# EAGLE design BeatlePad (EAGLE 9.2.0)
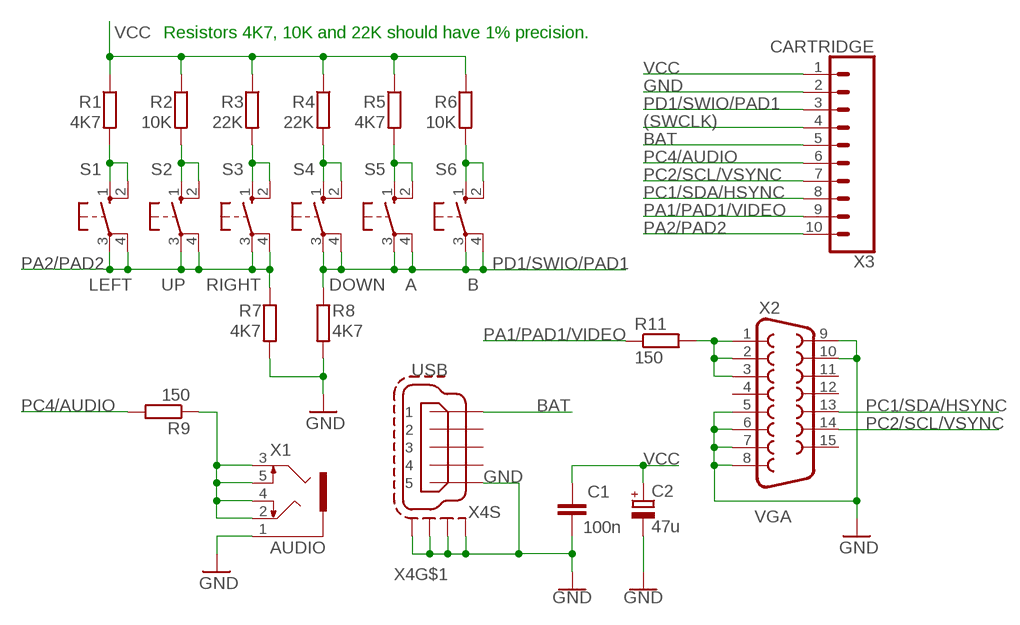
[diagram p0: schematic, sheet 1]

## Parts
C1  100n  C-EU025-024X044  [C025-024X044]
C2  47u  CPOL-EUE2-4  [E2-4]
R1  4K7  R-EU_0204/2V  [0204V]
R2  10K  R-EU_0204/2V  [0204V]
R3  22K  R-EU_0204/2V  [0204V]
R4  22K  R-EU_0204/2V  [0204V]
R5  4K7  R-EU_0204/2V  [0204V]
R6  10K  R-EU_0204/2V  [0204V]
R7  4K7  R-EU_0204/5  [0204/5]
R8  4K7  R-EU_0204/2V  [0204V]
R9  150  R-EU_0204/5  [0204/5]
R11  150  R-EU_0204/5  [0204/5]
S1  LEFT  10-XXB3F-10XXB  [B3F-10XXB]
S2  UP  10-XXB3F-10XXB  [B3F-10XXB]
S3  RIGHT  10-XXB3F-10XXB  [B3F-10XXB]
S4  DOWN  10-XXB3F-10XXB  [B3F-10XXB]
S5  A  10-XXB3F-10XXB  [B3F-10XXB]
S6  B  10-XXB3F-10XXB  [B3F-10XXB]
X1  AUDIO  1503_09  [1503_09]
X2  VGA  F15HDH  [HDF15H]
X3  CARTRIDGE  CONN_10  [1X10_LONGPADS]
X4  USB  MINI-USB-SCHIELD-32005-201  [32005-201]

## Nets
(SWCLK): X3.4
A: R5.2 S5.1(S) S5.2(S1)
B: R6.2 S6.1(S) S6.2(S1)
BAT: X3.5 X4.1
DOWN: R4.2 S4.1(S) S4.2(S1)
GND: C1.2 C2.- R7.2 R8.2 X1.1 X2.5 X2.6 X2.7 X2.8 X2.9 X2.10 X3.2 X4.5 X4.M1(S:S1) X4.M2(S:S2) X4.M3(S:S3) X4.M4(S:S4)
LEFT: R1.2 S1.1(S) S1.2(S1)
N$1: R11.2 X2.1 X2.2 X2.3
N$2: R9.1 X1.2 X1.3 X1.4 X1.5
PA1/PAD1/VIDEO: R11.1 X3.9
PA2/PAD2: R7.1 S1.3(P) S1.4(P1) S2.3(P) S2.4(P1) S3.3(P) S3.4(P1) X3.10
PC1/SDA/HSYNC: X2.13 X3.8
PC2/SCL/VSYNC: X2.14 X3.7
PC4/AUDIO: R9.2 X3.6
PD1/SWIO/PAD1: R8.1 S4.3(P) S4.4(P1) S5.3(P) S5.4(P1) S6.3(P) S6.4(P1) X3.3
RIGHT: R3.2 S3.1(S) S3.2(S1)
UP: R2.2 S2.1(S) S2.2(S1)
VCC: C1.1 C2.+ R1.1 R2.1 R3.1 R4.1 R5.1 R6.1 X3.1
Unconnected: X2.4 X2.11 X2.12 X2.15 X4.2 X4.3 X4.4

## Notes on the sheet
- Resistors 4K7, 10K and 22K should have 1% precision.

## Library data of the parts
C1 = rcl:C-EU: CAPACITOR, European symbol; SPICEPREFIX: C
C2 = rcl:CPOL-EU: POLARIZED CAPACITOR, European symbol; SPICEPREFIX: C
R1-R9 R11 = rcl:R-EU_: RESISTOR, European symbol; SPICEPREFIX: R
S1-S6 = switch-omron2:10-XX: OMRON SWITCH
X1 = con-lumberg:1503_09: Jack connectors according to JISC 6560, 3.5 mm Klinkeneinbaukupplung nach JISC 6560, 3,5 mm, 3-polig/ stereo, abgewinkelte Ausführung, mit 2 Öffnern und Lötaugen, für Leiterplatten Rückseitenmontage Source: http://www.lumberg.com/Produkte/PDFs/1503_09.pdf; OC_FARNELL: 1243244; OC_NEWARK: unknown
X2 = adafruit_B:F15: SUB-D HDH is also known as a 'right angle VGA' connector
X3 = SparkFun-Connectors:CONN_10: Multi connection point. Often used as Generic Header-pin footprint for 0.1 inch spaced/style header connections On any of the 0.1 inch spaced packages, you can populate with these: Break Away Headers - Straight <https://www.sparkfun.com/products/116> (PRT-00116) Break Away Male Headers - Right Angle <https://www.sparkfun.com/products/553> (PRT-00553) Female Headers <https://www.sparkfun.com/products/115> (PRT-00115) Break Away Headers - Machine Pin <https://www.sparkfun.com/products/117> (PRT-00117) Break Away Female Headers - Swiss Machine Pin <https://www.sparkfun.com/products/743> (PRT-00743) Arduino Stackable Header - 10 Pin <https://www.sparkfun.com/products/11376> (PRT-11376) For SCREWTERMINALS and SPRING TERMINALS visit here: Screw Terimnals on SparkFun.com <https://www.sparkfun.com/search/results?term=Screw+Terminals> (5mm/3.5mm/2.54mm spacing) This device is also useful as a general connection point to wire up your design to another part of your project. Our various solder wires solder well into these plated through hole pads. Hook-Up Wire - Assortment (Stranded, 22 AWG) <https://www.sparkfun.com/products/11375> (PRT-11375) Hook-Up Wire - Assortment (Solid Core, 22 AWG) <https://www.sparkfun.com/products/11367> (PRT-11367) View the entire wire category on our website here <https://www.sparkfun.com/categories/141> Special notes: Molex polarized connector foot print use with SKU : PRT-08231 with associated crimp pins and housings. 1MM SMD Version SKU: PRT-10208 NOTES ON THE VARIANTS LOCK and LOCK_LONGPADS... This footprint was designed to help hold the alignment of a through-hole component (i.e. 6-pin header) while soldering it into place. You may notice that each hole has been shifted either up or down by 0.005 of an inch from it's more standard position (which is a perfectly straight line). This slight alteration caused the pins (the squares in the middle) to touch the edges of the holes. Because they are alternating, it causes a "brace" to hold the component in place. 0.005 has proven to be the perfect amount of "off-center" position when using our standard breakaway headers. Although looks a little odd when you look at the bare footprint, once you have a header in there, the alteration is very hard to notice. Also,if you push a header all the way into place, it is covered up entirely on the bottom side.
X4 = con-cypressindustries:MINI-USB-SCHIELD-: MINI USB-B Conector Source: www.cypressindustries.com; OC_FARNELL: unknown; OC_NEWARK: unknown

## Board
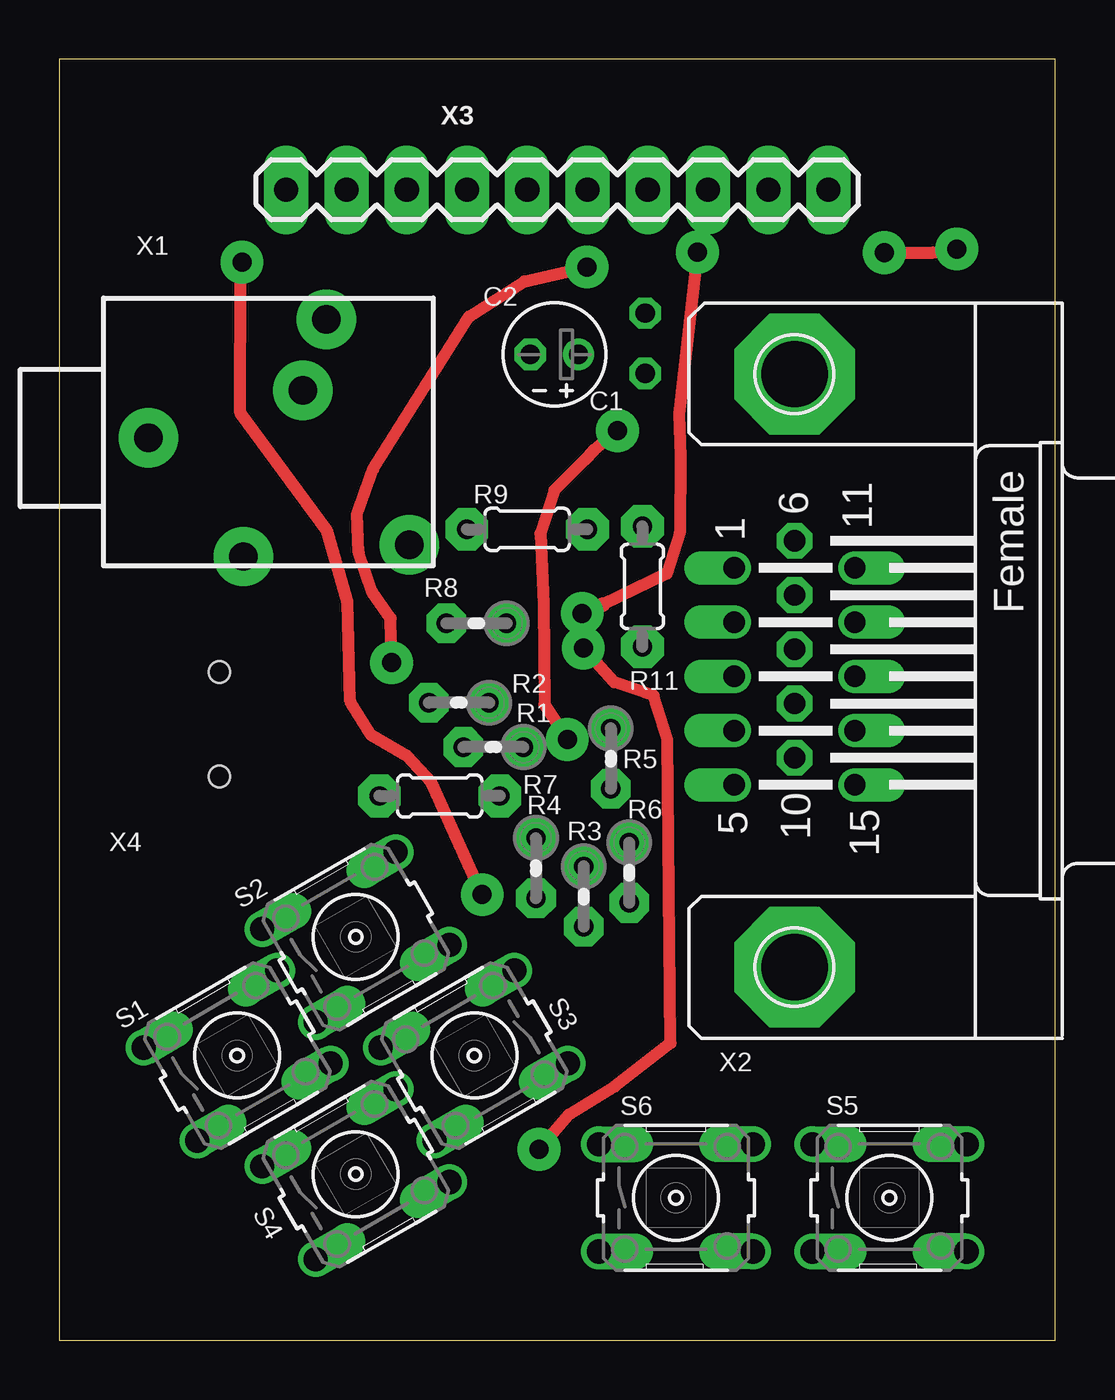
[diagram p1: board, top side]
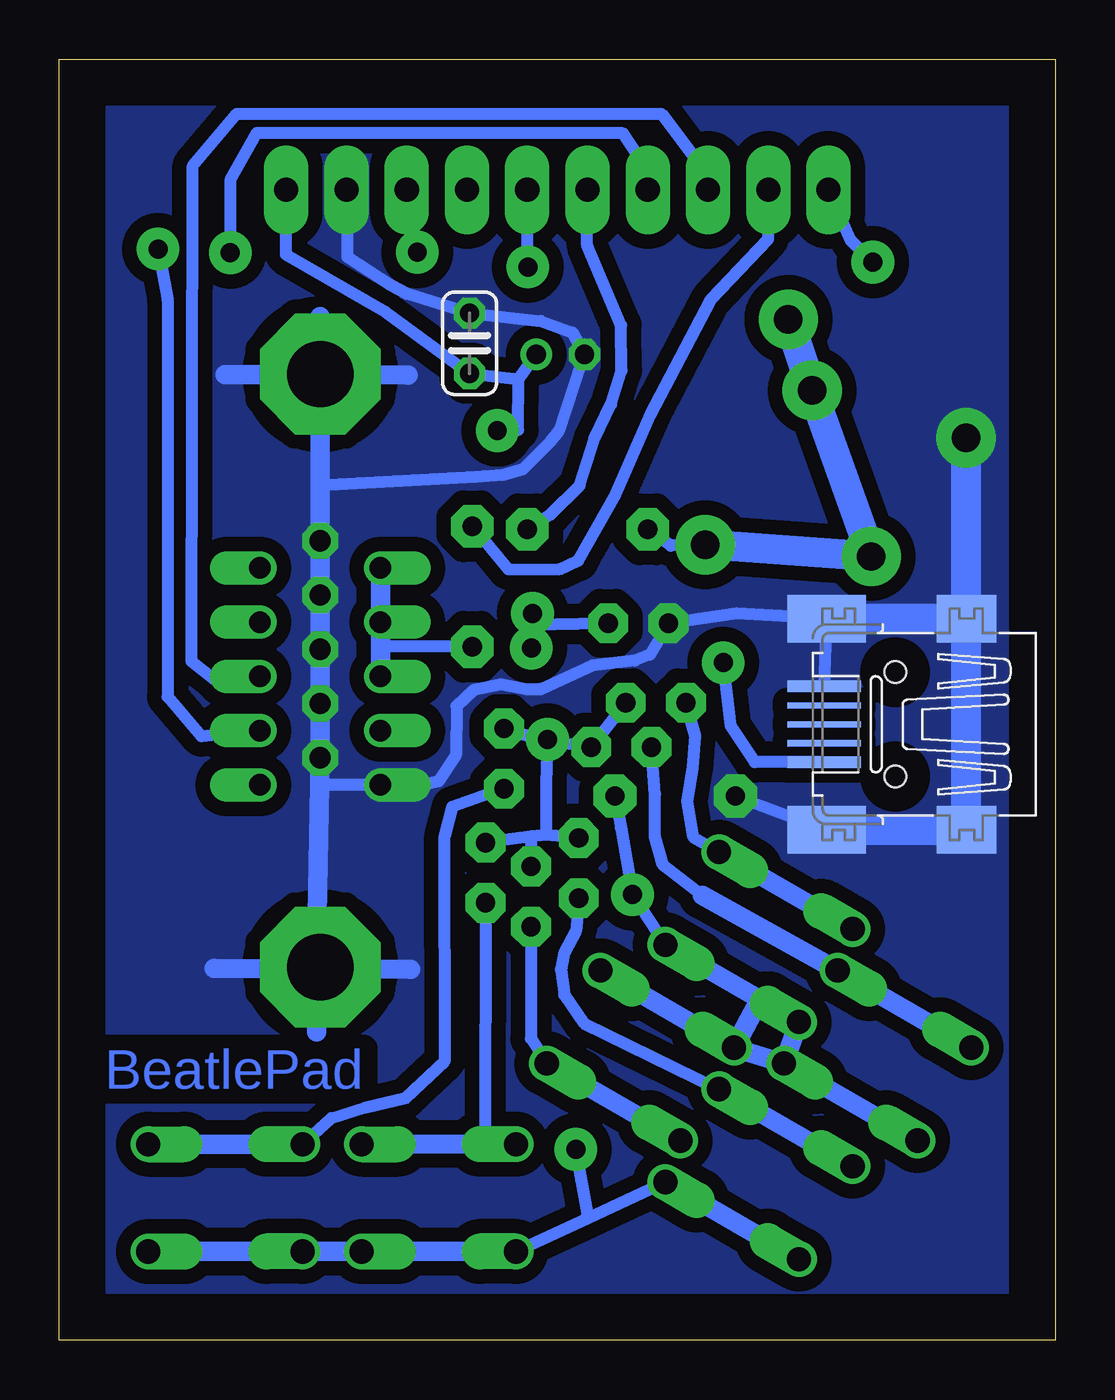
[diagram p2: board, bottom side, seen from below]

Size 42 x 54 mm. Coordinates in mm from the lower left corner, seen from the top.
Outline: 0,0 42,0 42,54 0,54 0,0
Copper layers (1*16): Top 0.035mm / dielectric 1.5mm / Bottom 0.035mm
Design rules "default": minimum track width 6mil, minimum drill 0.35mm, track to track 6mil, track to pad 6mil, pad to pad 6mil, via to via 6mil, smd to smd 6mil, copper to edge 40mil, drill to drill 6mil, minimum pad ring 10mil, minimum via ring 8mil, stop-mask expansion 4mil, vias tented up to drill 0mil, thermal gap 10mil

### Footprints (pad centres in the part's own frame; a part is rotated, then mirrored left to right if it is on the bottom)
C025-024X044 = drill 0.813 octagon: 1 -1.27,0; 2 1.27,0
E2-4 = drill 0.813 pad 1.27: + -1.016,0 | drill 0.813 pad 1.27 octagon: - 1.016,0
0204V = drill 0.813 pad 1.676 octagon: 1 -1.27,0; 2 1.27,0
0204/5 = drill 0.813 pad 1.8 octagon: 1 -2.54,0; 2 2.54,0
B3F-10XXB = drill 1.016 offset: 1 -3.251,2.261; 2 3.251,2.261; 3 -3.251,-2.261; 4 3.251,-2.261
1503_09 = drill 1.2 pad 2.5: 1 0,-2; 2 -5,-6; 3 5,-9.5; 4 -4.5,-13; 5 2,-8.5
HDF15H = drill 0.9 pad 1.27 offset: 1 4.329,2.54; 2 2.043,2.54; 3 -0.243,2.54; 4 -2.529,2.54; 5 -4.815,2.54; 11 4.329,-2.54; 12 2.043,-2.54; 13 -0.243,-2.54; 14 -2.529,-2.54; 15 -4.815,-2.54 | drill 0.9 pad 1.5 octagon: 6 5.472,0; 7 3.186,0; 8 0.9,0; 9 -1.386,0; 10 -3.672,0 | drill 2.8 pad 5.08 octagon: P$1 -12.5,0; P$2 12.5,0
1X10_LONGPADS = drill 1.016 pad 1.88 long: 1 -11.43,0; 2 -8.89,0; 3 -6.35,0; 4 -3.81,0; 5 -1.27,0; 6 1.27,0; 7 3.81,0; 8 6.35,0; 9 8.89,0; 10 11.43,0
32005-201 = smd 3.1 x 0.5: 1 3,1.6; 5 3,-1.6 | smd 3.1 x 0.254: 2 3,0.8; 3 3,0; 4 3,-0.8 | smd 2.5 x 2: M1 -3,-4.45; M2 -3,4.45 | smd 3.3 x 2: M3 2.9,4.45; M4 2.9,-4.45 | hole 0.9: 0,2.2; 0,-2.2

### Placement (x,y rotation side)
C1  24.7,42.03 90 bottom
C2  20.88,41.56 180 top
R1  18.3,25 180 top
R2  16.85,26.88 180 top
R3  22.11,18.7 270 top
R4  20.09,19.9 270 top
R5  23.25,24.52 270 top
R6  24.03,19.71 270 top
R7  16.04,22.95 180 top
R8  17.59,30.22 180 top
R9  19.73,34.18 0 top
R11  24.58,31.78 270 top
S1  7.5,12 30 top
S2  12.5,17 30 top
S3  17.5,12 210 top
S4  12.5,7 30 top
S5  35,6 0 top
S6  26,6 0 top
X1  1.76,38.04 90 top
X2  31,28.23 90 top
X3  21,48.5 180 top
X4  6.75,25.97 180 bottom

### Tracks (layer width: path | path; a pad name or v marks a point on that pad's centre or on a via)
A
  Bottom 0.508: S5.1 30.53,9.36 29.09,9.81 27.39,10.21 25.75,11.78 25.75,21.26 25.44,22.48 R5.2
  Bottom 0.813: S5.1 S5.2
B
  Bottom 0.508: 23.29,8.2 S6.1 | R6.2 24.04,8.28
  Bottom 0.813: S6.1 24.04,8.28 S6.2
BAT  (via drill 0.8 pad 1.8)
  Top 0.508: v14.01,28.56 13.97,30.43 13.2,31.53 12.62,33.2 12.55,34.82 13.24,36.72 17.28,43.16 19.59,44.63 v22.25,45.24
  Bottom 0.508: X4.1 12.68,24.37 13.69,25.9 v14.01,28.56 | v22.25,45.24 X3.5
DOWN
  Bottom 0.508: R4.2 20.17,17.65 20.22,17.25 20.71,16.31 20.85,15.63 20.71,14.56 19.87,13.36 S4.2
  Bottom 0.813: S4.1 S4.2
GND
  Bottom 0.508: X3.2 29.86,45.68 28.06,44.5 27.34,44.12 C1.2 21.7,42.96 20.36,42.48 C2.- 20,41.18 20.94,38.33 21.29,37.88 22.46,36.71 23.29,36.48 24.44,36.39 31,36.04 | X4.5 X4.M4 13.45,30.64 R8.2 17.11,28.9 17.73,28.64 19.5,28.45 21.7,27.43 22.31,27.44 23.38,27.64 24.51,27.41 25.26,26.73 25.28,24.66 26,23.56 26.88,23.37 X2.5 31.02,23.41 | R7.2 X4.M3
  Bottom 0.813: 31,40.72 31,36.04 X2.6 X2.7 X2.8 X2.9 X2.10 31.02,23.41 31.16,15.65 | 31,40.72 31,43.15 | 31,40.72 27.3,40.68 | 31,40.72 35,40.72 | 31.16,15.65 31.14,12.99 | 31.16,15.65 27.2,15.64 | 31.16,15.65 35.47,15.68
  Bottom 1.27: X4.M4 X4.M1 | X4.M3 X4.M2 X4.M1 | X4.M1 X1.1
  pour Bottom (isolate 0.61, no thermals): 2,2 2,52 40,52 40,2
LEFT
  Bottom 0.508: 14.89,18.76 16.54,20.03 16.89,21.23 16.88,23.01 R1.2
  Bottom 0.813: S1.1 S1.2 14.89,18.76
N$1
  Bottom 0.508: R11.2 28.46,29.24
  Bottom 0.813: X2.3 28.46,29.24 X2.2 X2.1
N$2
  Bottom 0.508: X1.4 16.22,33.5 R9.1
  Bottom 1.27: X1.3 X1.5 X1.2 X1.4
PA1/PAD1/VIDEO
  Bottom 0.508: R11.1 23.08,32.5 20.93,32.49 20.13,32.86 18.54,35.69 17.07,39.03 14.52,43.87 12.11,46.42 X3.9
PA2/PAD2  (via drill 0.8 pad 1.8)
  Top 0.508: v17.83,18.79 15.69,23.5 14.66,24.63 13.14,25.52 12.27,26.93 12.15,31.11 11.29,34.14 7.63,39.1 7.65,44.96 v7.7,45.45
  Bottom 0.508: X3.10 8.62,46.35 v7.7,45.45 | R7.1 18.33,21.61 v17.83,18.79 S2.4
  Bottom 0.813: S1.4 S1.3 | S1.4 S3.4 | S3.4 S3.3 | S2.4 12.47,14.36 | 12.47,14.36 S2.3 S1.4 | S3.4 12.47,14.36
PC1/SDA/HSYNC
  Bottom 0.508: X2.13 35.4,27.81 36.43,28.62 36.38,49.51 34.51,51.7 16.62,51.7 14.63,49.08 X3.8
PC2/SCL/VSYNC  (via drill 0.8 pad 1.8)
  Top 0.508: v34.79,45.85 36.83,45.85 v37.84,46
  Bottom 0.508: X3.7 17.19,49.3 18.23,50.88 33.67,50.89 34.79,48.9 v34.79,45.85 | v37.84,46 37.44,43.86 37.43,27.13 36.02,25.47 X2.14
PC4/AUDIO
  Bottom 0.508: R9.2 21.3,34.8 20.06,36.04 19.44,38.01 18.74,39.46 18.3,40.88 18.31,42.77 19.75,46.16 X3.6
PD1/SWIO/PAD1  (via drill 0.8 pad 1.8)
  Top 0.508: v20.22,8.05 21.48,9.52 23.41,10.7 25.78,12.53 25.64,25.32 25.06,27.17 23.4,27.74 v22.09,29.18 | v26.91,45.87 26.13,39.04 26.2,37.28 26.16,34.04 25.62,32.31 22.92,31.02
  Top 0.61: 22.92,31.02 v22.05,30.64
  Bottom 0.508: S6.3 19.68,5.16 | 19.68,5.16 S4.4 | 19.68,5.16 v20.22,8.05 | R8.1 19.07,30.23 22.1,30.16 v22.09,29.18 v22.05,30.64 | X3.3 v26.91,45.87
  Bottom 0.813: S5.4 S5.3 S6.4 S6.3 | S4.4 S4.3
RIGHT
  Bottom 0.508: R3.2 22.12,12.72 S3.1
  Bottom 0.813: S3.1 S3.2
UP
  Bottom 0.508: S2.2 15.26,21.2 15.52,22.72 15.29,24.14 15.18,25.48 R2.2
  Bottom 0.813: S2.1 S2.2
VCC  (via drill 0.8 pad 1.8)
  Top 0.508: v23.53,38.34 22.54,37.53 22.13,37.08 20.88,35.83 20.28,34 20.42,31.06 20.45,26.8 v21.42,25.32
  Bottom 0.508: X3.1 32.46,45.77 28.25,43.35 C1.1 22.64,40.52 | 22.64,40.52 C2.+ | R4.1 21.48,21.3 | 21.48,21.3 22.09,21.24 | 22.09,21.24 R6.1 | R3.1 22.09,21.24 | R2.1 R1.1 21.47,25.26 | 21.47,25.26 v21.42,25.32 21.47,23.51 21.48,21.3 | R5.1 21.47,25.26 | 22.64,40.52 22.65,38.38 v23.53,38.34

### Text on the board
Bottom: BeatlePad